# EAGLE design pcbschem2 (EAGLE 9.6.2)
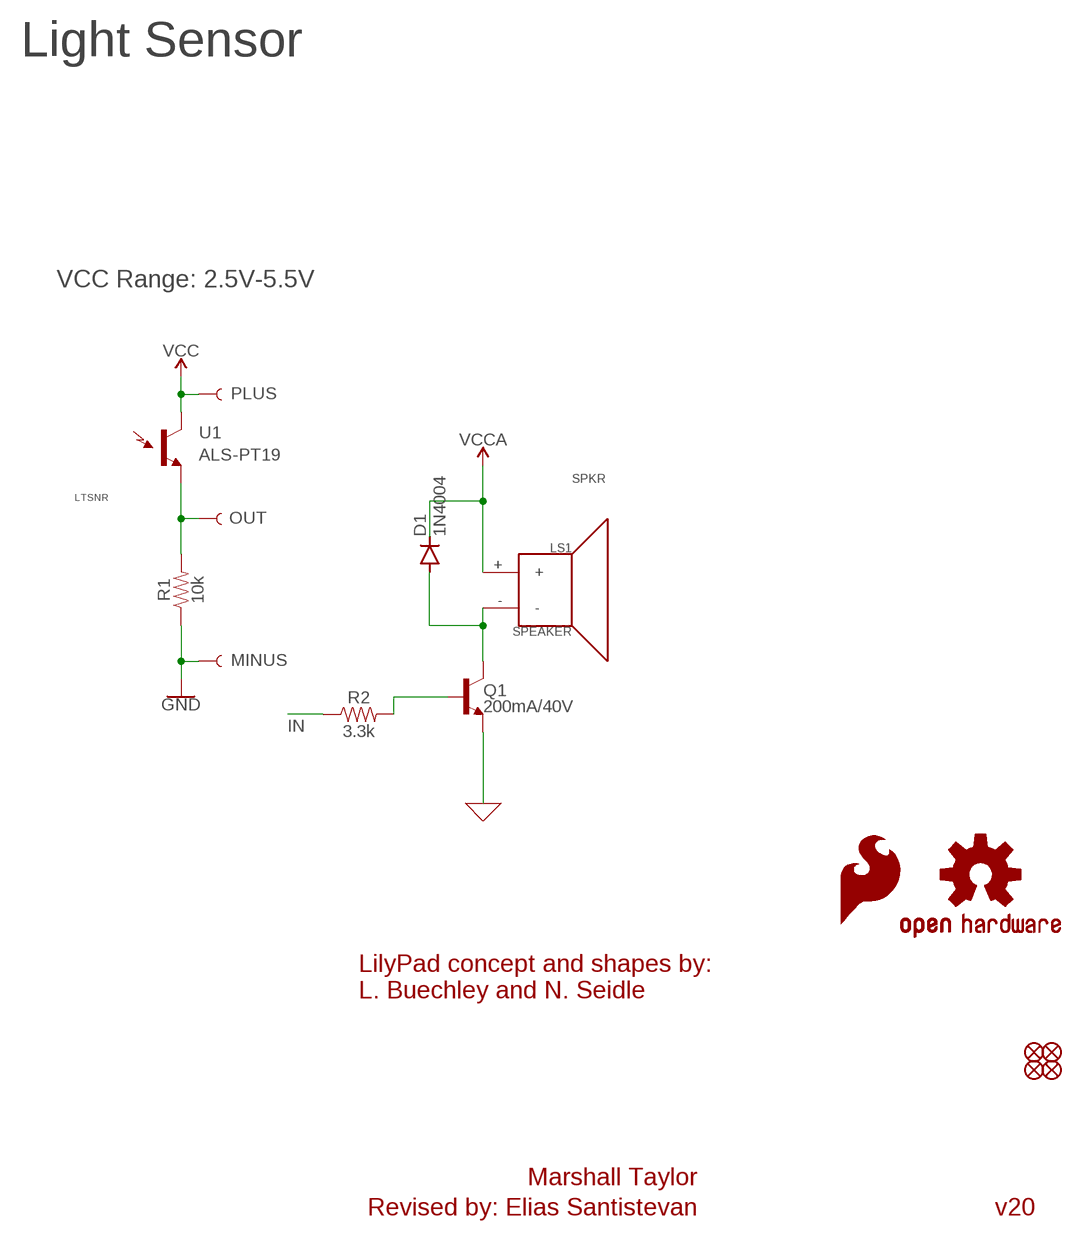
[diagram p0: schematic, sheet 1]

## Parts
D1  1N4004  [DO41-10]
FD1  FIDUCIALUFIDUCIAL  [FIDUCIAL-MICRO]
FD2  FIDUCIALUFIDUCIAL  [FIDUCIAL-MICRO]
FD3  FIDUCIALUFIDUCIAL  [FIDUCIAL-MICRO]
FD4  FIDUCIALUFIDUCIAL  [FIDUCIAL-MICRO]
LOGO1  OSHW-LOGOMINI  [OSHW-LOGO-MINI]
LOGO2  SFE_LOGO_FLAME.1_INCH  [SFE_LOGO_FLAME_.1]
LS1  SPEAKER  [PCB_MOUNT_SPEAKER]
Q1  200mA/40V  TRANS_NPN-2N3904  [TO-92]
R1  10k  10KOHM-0603-1/10W-1%  [0603]
R2  3.3k  3.3KOHM-0603-1/10W-1%  [0603]
SEWTAPLS+  PLUS  SEWTAP_SMALL-2SIDE  [PETAL-SMALL-2SIDE]
SEWTAPLS-  MINUS  SEWTAP_SMALL-2SIDE  [PETAL-SMALL-2SIDE]
SEWTAPLSOUT  OUT  SEWTAP_SMALL-2SIDE  [PETAL-SMALL-2SIDE]
U1  ALS-PT19  LIGHT_SENSORALS  [ALS-PT19]

## Nets
0: Q1.1(E) ; supply symbol labelled GND
3.3V: SEWTAPLS+.1 U1.C(C1) ; supply symbol labelled VCC
GND: R1.1 SEWTAPLS-.1
IN: R2.1
LTSNR: R1.2 SEWTAPLSOUT.1 U1.E(E1)
N$1: Q1.2(B) R2.2
N$2: D1.A LS1.- Q1.3(C)
SPKR: D1.C LS1.+ ; supply symbol labelled VCCA

## Notes on the sheet
- Light Sensor
- VCC Range: 2.5V-5.5V
- LilyPad concept and shapes by: 
  L. Buechley and N. Seidle
- Marshall Taylor
- Revised by: Elias Santistevan | v20

## Library data of the parts
D1 = diode:1N4004: DIODE general purpose rectifier, 1 A
FD1-FD4 = SparkFun-Aesthetics:FIDUCIAL: Fiducial Alignment Points Point-of-reference for pick-and-place machines and other optical instruments.
LOGO1 = SparkFun-Aesthetics:OSHW-LOGO: Open Source Hardware Logo This logo indicates the piece of hardware it is found on incorporates a OSHW license and/or adheres to the definition of open source hardware found here: http://freedomdefined.org/OSHW
LOGO2 = SparkFun-Aesthetics:SFE_LOGO_FLAME: SFE Logo, flame only This is the SparkFun flame logo. The logo on the schematic will always be the same size; the package variant is the height of the flame. Default layer for the logo on the board is tSilk.
LS1 = SparkFun-Electromechanical:SPEAKER: Speaker Generic 2-terminal loudspeakers SparkFun Products Speaker - PCB Mount <https://www.sparkfun.com/products/11089> (COM-11089); PROD_ID: COMP-11789; SF_SKU: COM-11089
Q1 = SparkFun-DiscreteSemi:TRANS_NPN: NPN transistor Current controlled devices typically used to amplify current or used as a switch. BC547 - COM-08928 <http://www.sparkfun.com/products/8928> (TO-92 45V 100mA) (1.Collector 2.Base 3.Emitter) 2N3904 - COM-00521 <http://www.sparkfun.com/products/521> (TO-92 40V 200mA) (1.Emitter 2.Base 3.Collector) P2N2222A - COM-12852 <http://www.sparkfun.com/products/12852> (TO-92 40V 600mA) (1.Collector 2.Base 3.Emitter); PROD_ID: TRANS-08447
R1 = SparkFun-Resistors:10KOHM: 10kΩ resistor A resistor is a passive two-terminal electrical component that implements electrical resistance as a circuit element. Resistors act to reduce current flow, and, at the same time, act to lower voltage levels within circuits. - Wikipedia; PROD_ID: RES-00824
R2 = SparkFun-Resistors:3.3KOHM: 3.3kΩ resistor A resistor is a passive two-terminal electrical component that implements electrical resistance as a circuit element. Resistors act to reduce current flow, and, at the same time, act to lower voltage levels within circuits. - Wikipedia; PROD_ID: RES-07851
SEWTAPLS+ SEWTAPLS- SEWTAPLSOUT = LilyPad-Wearables:SEWTAP: SparkFun LilyPad Sew Taps Sewable connection points for LilyPad Boards SparkFun Products: LilyPad Arduino 328 Main Board <https://www.sparkfun.com/products/13342> LilyTiny <https://www.sparkfun.com/products/10899> LilyPad Power Supply <https://www.sparkfun.com/products/11259>
U1 = SparkFun-Sensors:LIGHT_SENSOR: Ambient Light Sensors - Phototransistors Low cost ambient light sensors, consisting of a phototransistor in miniature SMD packages. Output voltage varies with light intensity. SparkFun Products ALS-PT19 Light Sensor <https://www.sparkfun.com/products/12566> (SEN-12566) Ambient Light Sensor - TEMT6000 <https://www.sparkfun.com/products/8348> (SEN-08348) SparkFun Ambient Light Sensor Breakout - TEMT60000 <https://www.sparkfun.com/products/8688> (SEN-08688); PROD_ID: IC-11836; SF_ID: SEN-12566

## Board
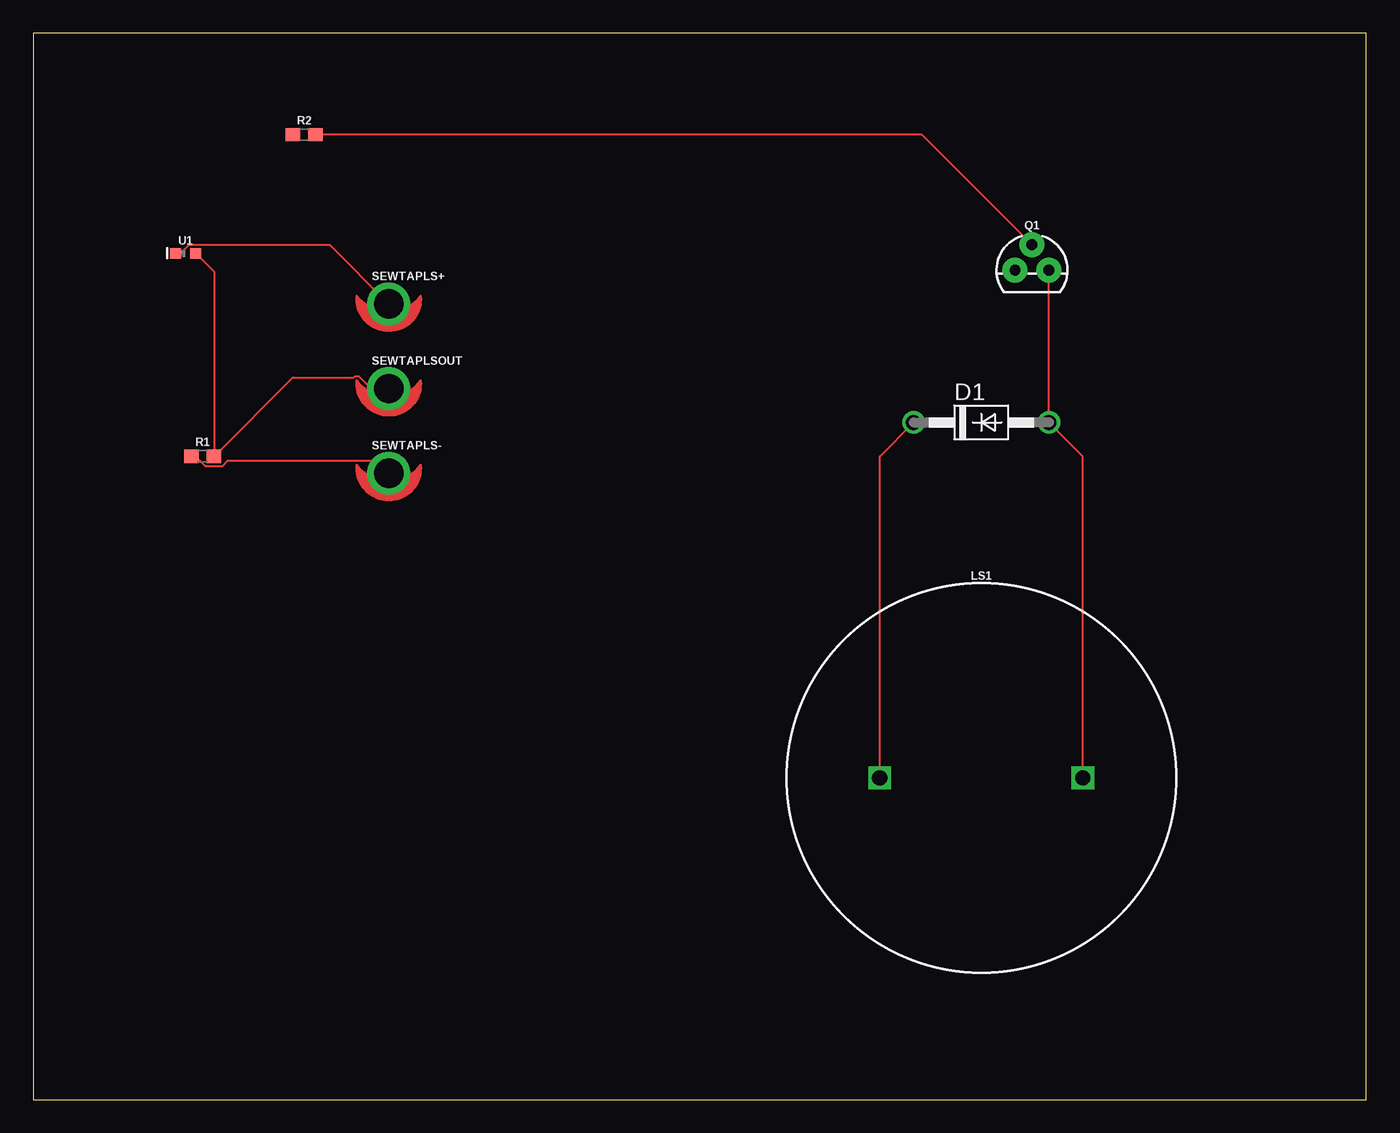
[diagram p1: board, top side]
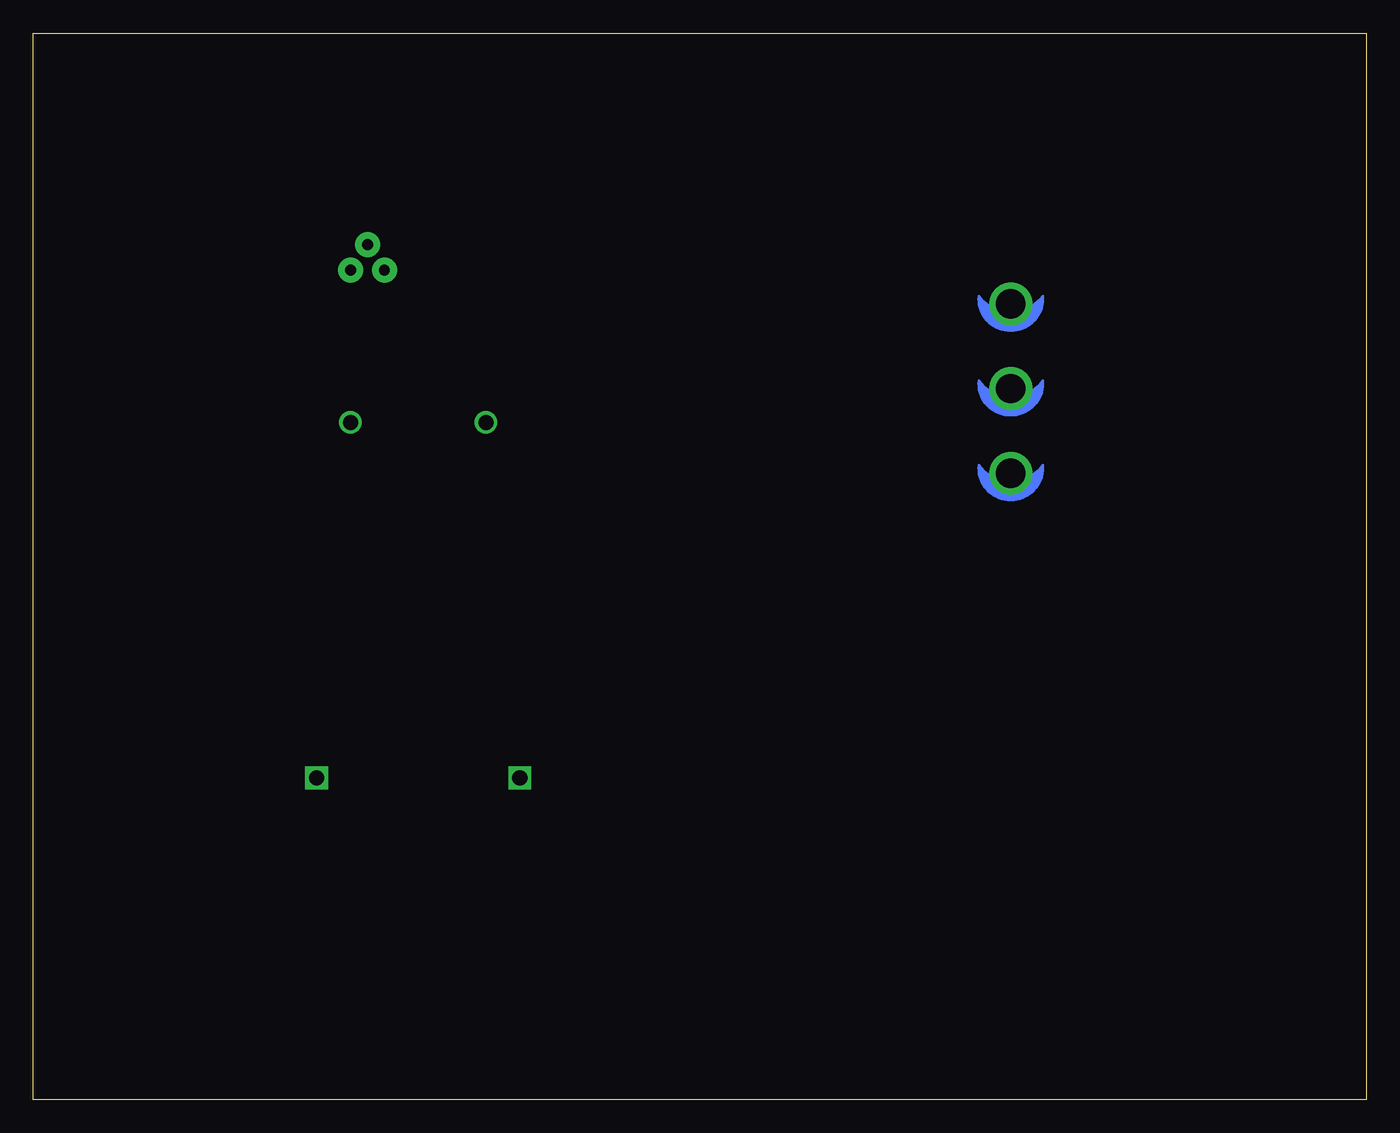
[diagram p2: board, bottom side, seen from below]

Size 100 x 80 mm. Coordinates in mm from the lower left corner, seen from the top.
Outline: 0,0 100,0 100,80 0,80 0,0
Copper layers (1*16): Top 0.035mm / dielectric 1.5mm / Bottom 0.035mm
Design rules "default": minimum track width 6mil, minimum drill 0.35mm, track to track 6mil, track to pad 6mil, pad to pad 6mil, via to via 6mil, smd to smd 6mil, copper to edge 40mil, drill to drill 6mil, minimum pad ring 10mil, minimum via ring 8mil, stop-mask expansion 4mil, vias tented up to drill 0mil, thermal gap 10mil

### Footprints (pad centres in the part's own frame; a part is rotated, then mirrored left to right if it is on the bottom)
DO41-10 = drill 1.118: A 5.08,0; C -5.08,0
FIDUCIAL-MICRO = smd 0.635 x 0.635: 1 0,0
PCB_MOUNT_SPEAKER = drill 1.143 square: + -7.62,0; - 7.62,0
TO-92 = drill 0.813 pad 1.88: 1 -1.27,0; 2 0,1.905; 3 1.27,0
0603 = smd 1.1 x 1: 1 -0.85,0; 2 0.85,0
PETAL-SMALL-2SIDE = drill 2.2: 1 0,0
ALS-PT19 = smd 0.8 x 0.8: C -0.75,0; E 0.75,0

### Placement (x,y rotation side)
D1  71.12,50.8 0 top
FD1  -72.39,95.25 0 top  (outside the outline)
FD2  -74.93,95.25 0 top  (outside the outline)
FD3  -77.47,95.25 0 top  (outside the outline)
FD4  -80.01,95.25 0 top  (outside the outline)
LOGO1  -69.85,95.25 0 top  (outside the outline)
LOGO2  -53.34,95.25 0 top  (outside the outline)
LS1  71.12,24.13 0 top
Q1  74.93,62.23 0 top
R1  12.7,48.26 0 top
R2  20.32,72.39 0 top
SEWTAPLS+  26.67,59.69 0 top
SEWTAPLS-  26.67,46.99 0 top
SEWTAPLSOUT  26.67,53.34 0 top
U1  11.43,63.5 0 top

### Tracks (layer width: path | path; a pad name or v marks a point on that pad's centre or on a via)
3.3V
  Top 0.152: U1.C 11.06,63.5 11.69,64.13 22.23,64.13 SEWTAPLS+.1
GND
  Top 0.152: R1.1 12.18,48.26 12.9,47.53 14.2,47.53 14.59,47.93 25.73,47.93 SEWTAPLS-.1
LTSNR
  Top 0.152: U1.E 13.55,62.13 R1.2 19.47,54.18 24.05,54.18 24.14,54.27 24.15,54.27 24.16,54.28 24.29,54.27 24.42,54.27 25.11,53.58 25.39,53.4 25.52,53.34 SEWTAPLSOUT.1
N$1
  Top 0.152: Q1.2 66.67,72.39 R2.2
N$2
  Top 0.152: LS1.- 78.74,48.26 D1.A Q1.3
SPKR
  Top 0.152: LS1.+ 63.5,48.26 D1.C